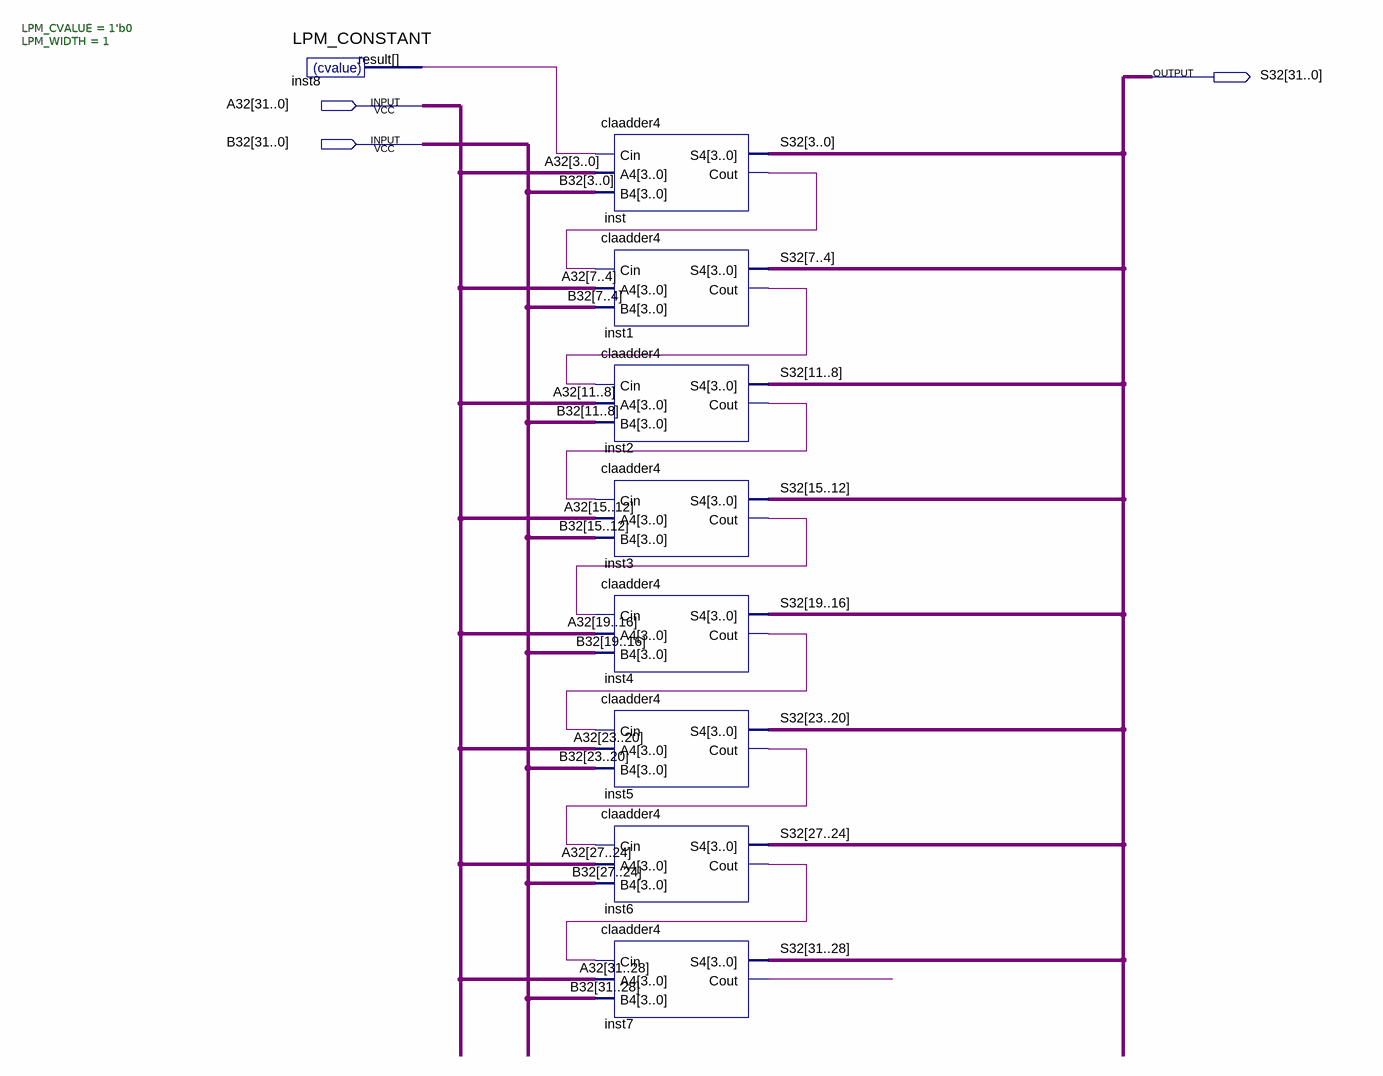
[diagram p0: schematic sheet]
// Quartus schematic claadder32.bdf as structural Verilog: 9 symbols, 3 pins
module claadder32 (
  input  [31:0] A32,
  input  [31:0] B32,
  output [31:0] S32
);

  wire inst1_cout, inst2_cout, inst3_cout, inst4_cout, inst5_cout, inst6_cout, inst7_cout, inst8_result,
       inst_cout;

  LPM_CONSTANT #(.LPM_CVALUE(1'b0), .LPM_WIDTH(1)) inst8 (.result(inst8_result));
  claadder4 inst (.Cin(inst8_result), .A4(A32[3:0]), .B4(B32[3:0]), .S4(S32[3:0]), .Cout(inst_cout));
  claadder4 inst1 (.Cin(inst_cout), .A4(A32[7:4]), .B4(B32[7:4]), .S4(S32[7:4]), .Cout(inst1_cout));
  claadder4 inst2 (.Cin(inst1_cout), .A4(A32[11:8]), .B4(B32[11:8]), .S4(S32[11:8]), .Cout(inst2_cout));
  claadder4 inst3 (.Cin(inst2_cout), .A4(A32[15:12]), .B4(B32[15:12]), .S4(S32[15:12]), .Cout(inst3_cout));
  claadder4 inst4 (.Cin(inst3_cout), .A4(A32[19:16]), .B4(B32[19:16]), .S4(S32[19:16]), .Cout(inst4_cout));
  claadder4 inst5 (.Cin(inst4_cout), .A4(A32[23:20]), .B4(B32[23:20]), .S4(S32[23:20]), .Cout(inst5_cout));
  claadder4 inst6 (.Cin(inst5_cout), .A4(A32[27:24]), .B4(B32[27:24]), .S4(S32[27:24]), .Cout(inst6_cout));
  claadder4 inst7 (.Cin(inst6_cout), .A4(A32[31:28]), .B4(B32[31:28]), .S4(S32[31:28]), .Cout(inst7_cout));
endmodule
